# EAGLE design C64_Promenade (EAGLE 9.5.2)
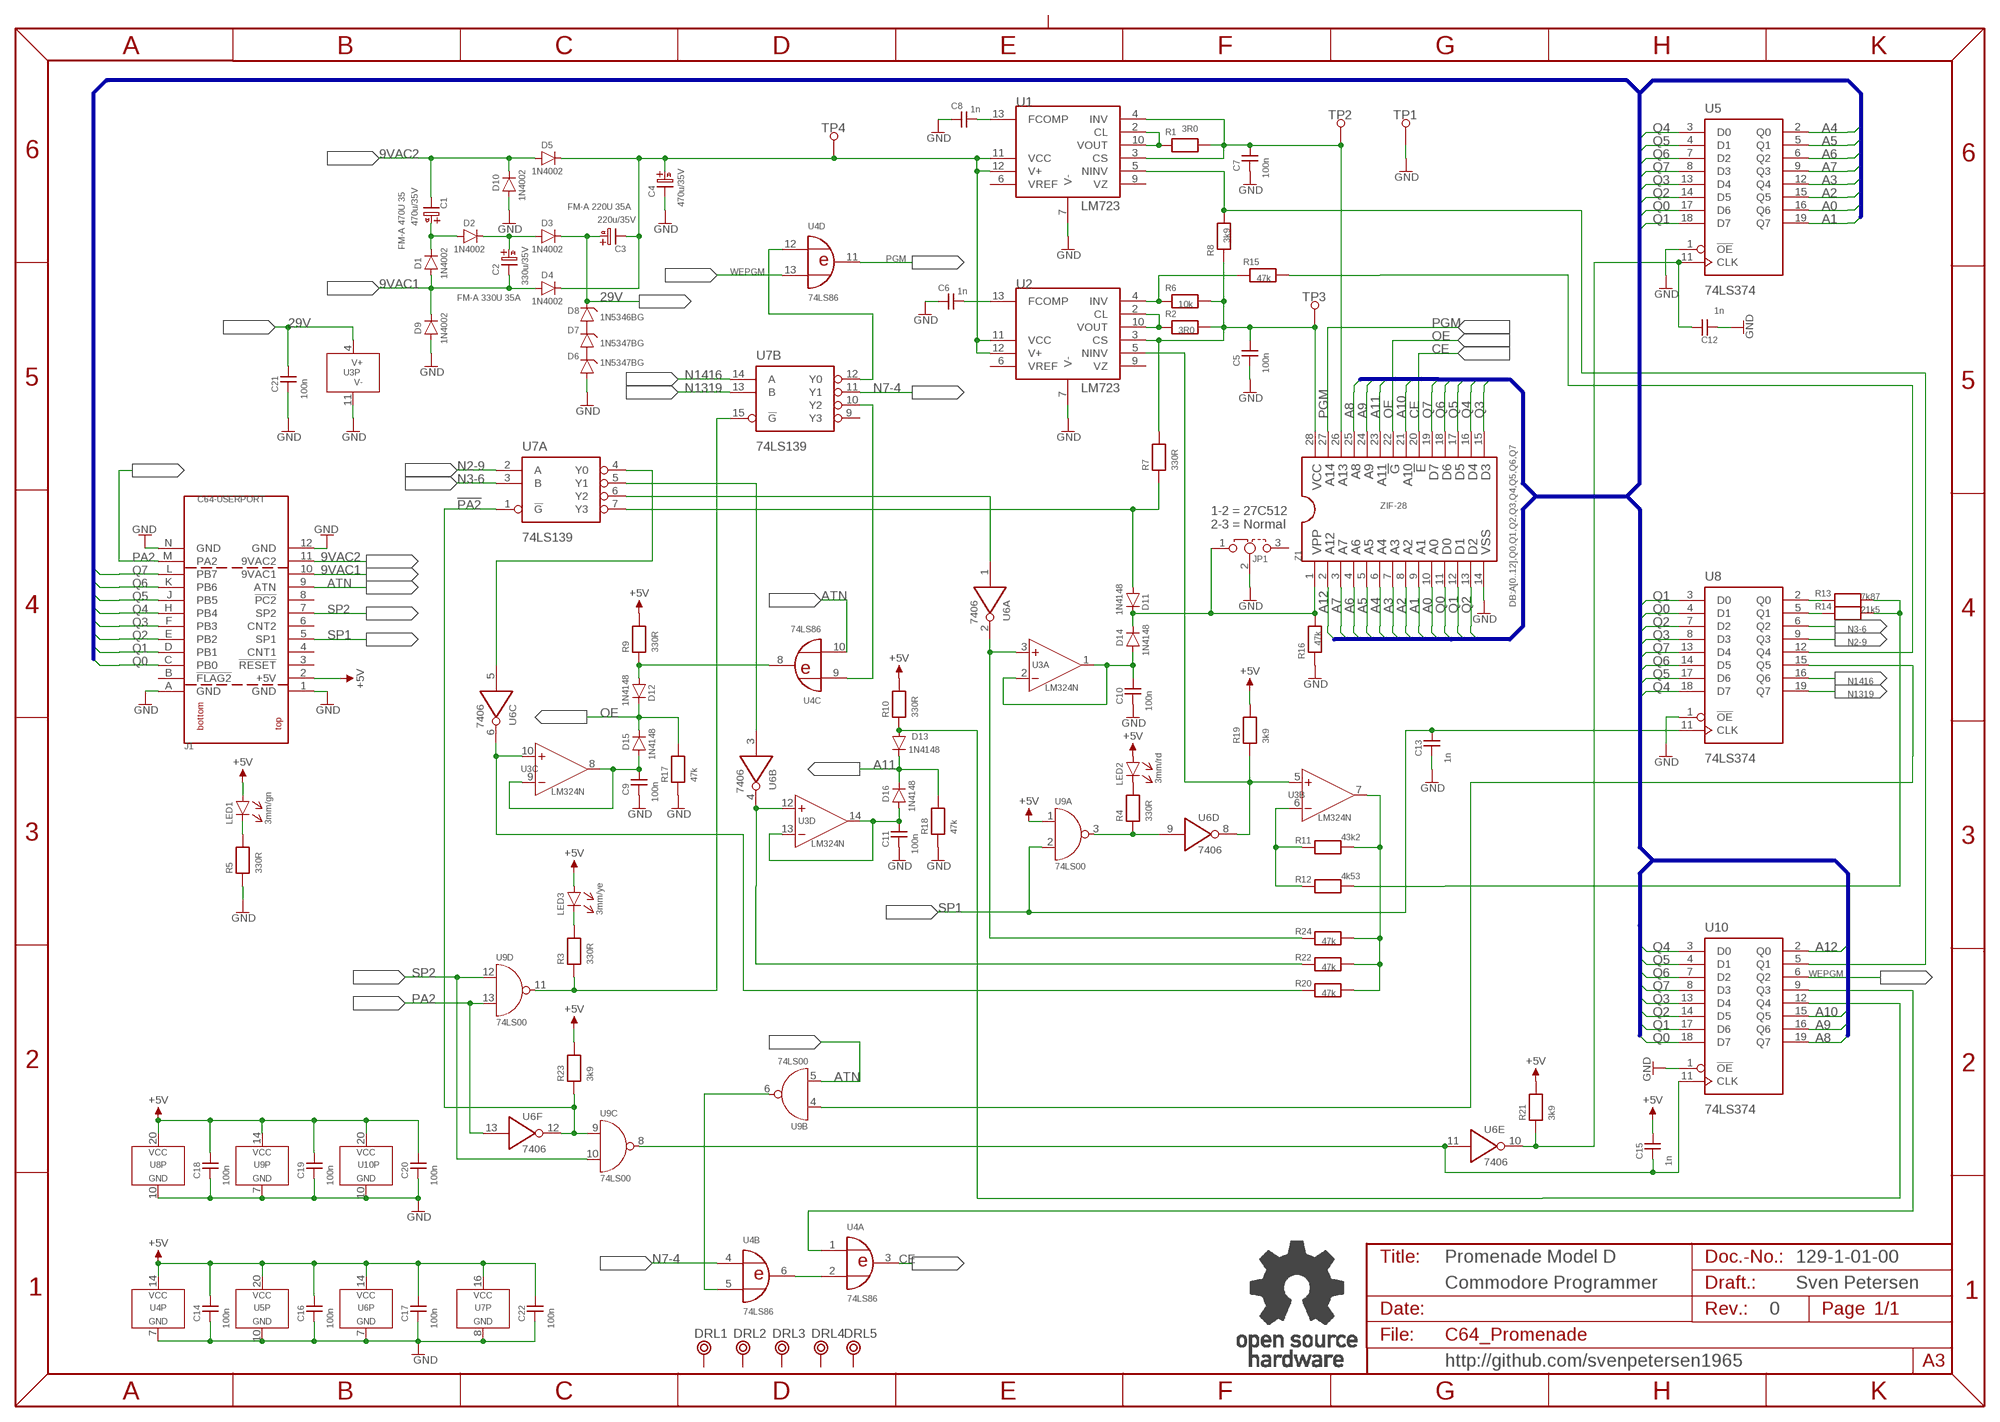
[diagram p0: schematic, sheet 1]

## Parts
C1  470u/35V  C10/5,0  [C10/5,0]
C2  330u/35V  C10/5,0  [C10/5,0]
C3  220u/35V  C10/5,0  [C10/5,0]
C4  470u/35V  C10/5,0  [C10/5,0]
C5  100n  CAP01  [C-2,5]
C6  1n  CAP01  [C-2,5]
C7  100n  CAP01  [C-2,5]
C8  1n  CAP01  [C-2,5]
C9  100n  CAP01  [C-2,5]
C10  100n  CAP01  [C-2,5]
C11  100n  CAP01  [C-2,5]
C12  1n  CAP01  [C-2,5]
C13  1n  CAP01  [C-2,5]
C14  100n  CAP01  [C-2,5]
C15  1n  CAP01  [C-2,5]
C16  100n  CAP01  [C-2,5]
C17  100n  CAP01  [C-2,5]
C18  100n  CAP01  [C-2,5]
C19  100n  CAP01  [C-2,5]
C20  100n  CAP01  [C-2,5]
C21  100n  CAP01  [C-2,5]
C22  100n  CAP01  [C-2,5]
D1  1N4002  [DO-41]
D2  1N4002  [DO-41]
D3  1N4002  [DO-41]
D4  1N4002  [DO-41]
D5  1N4002  [DO-41]
D6  1N5347BG  [017AA]
D7  1N5347BG  [017AA]
D8  1N5346BG  [017AA]
D9  1N4002  [DO-41]
D10  1N4002  [DO-41]
D11  1N4148  [DO-35]
D12  1N4148  [DO-35]
D13  1N4148  [DO-35]
D14  1N4148  [DO-35]
D15  1N4148  [DO-35]
D16  1N4148  [DO-35]
DRL1  BOHR3,5  [BOHR3,5]
DRL2  BOHR3,5  [BOHR3,5]
DRL3  BOHR3,5  [BOHR3,5]
DRL4  BOHR3,5  [BOHR3,5]
DRL5  BOHR3,5  [BOHR3,5]
J1  C64-USERPORT  [USERPORT]
JP1  DJUMPER  [1X03]
LED1  3mm/gn  3MM  [3MM]
LED2  3mm/rd  3MM  [3MM]
LED3  3mm/ye  3MM  [3MM]
R1  3R0  RES04  [R-10]
R2  3R0  RES04  [R-10]
R3  330R  RES04  [R-10]
R4  330R  RES04  [R-10]
R5  330R  RES04  [R-10]
R6  10k  RES04  [R-10]
R7  330R  RES04  [R-10]
R8  3k9  RES04  [R-10]
R9  330R  RES04  [R-10]
R10  330R  RES04  [R-10]
R11  43k2  RES04  [R-10]
R12  4k53  RES04  [R-10]
R13  7k87  RES04  [R-10]
R14  21k5  RES04  [R-10]
R15  47k  RES04  [R-10]
R16  47k  RES04  [R-10]
R17  47k  RES04  [R-10]
R18  47k  RES04  [R-10]
R19  3k9  RES04  [R-10]
R20  47k  RES04  [R-10]
R21  3k9  RES04  [R-10]
R22  47k  RES04  [R-10]
R23  3k9  RES04  [R-10]
R24  47k  RES04  [R-10]
TP1  1,3/2,0  [1,3/2,0]
TP2  1,3/2,0  [1,3/2,0]
TP3  1,3/2,0  [1,3/2,0]
TP4  1,3/2,0  [1,3/2,0]
U1  LM723  [DIL-14]
U2  LM723  [DIL-14]
U3  LM324N  [DIL-14]
U4  74LS86  7486N  [DIL-14]
U5  74LS374  74374N  [DIL-20]
U6  7406  7406N  [DIL-14]
U7  74LS139  74139N  [DIL-16]
U8  74LS374  74374N  [DIL-20]
U9  74LS00  7400DIP  [DIL-14]
U10  74LS374  74374N  [DIL-20]
U$80  OPEN_SOURCE_HW  [OPENHW]
Z1  ZIF-28  [ZIF28]

## Nets
9VAC1: C2.- D1.A D4.A D9.K J1.10(9VAC1)
9VAC2: C1.- D5.A D10.K J1.11(9VAC2)
29V: C3.+ C21.2 D3.K D8.K U3.4(P:V+)
!PA2: R23.1 U6.12(F:O) U7.1(A:!G) U9.9(C:I0)
+5V: C14.2 C15.2 C16.2 C17.2 C18.2 C19.2 C20.2 C22.2 J1.2(+5V) LED1.A LED2.A LED3.A R9.2 R10.2 R19.2 R21.2 R23.2 U4.14(P:VCC) U5.20(VCC) U6.14(P:VCC) U7.16(P:VCC) U8.20(VCC) U9.1(A:I0) U9.14(P:VCC) U10.20(VCC)
A0: U5.16(Q6) Z1.10
A1: U5.19(Q7) Z1.9
A2: U5.15(Q5) Z1.8
A3: U5.12(Q4) Z1.7
A4: U5.2(Q0) Z1.6
A5: U5.5(Q1) Z1.5
A6: U5.6(Q2) Z1.4
A7: U5.9(Q3) Z1.3
A8: U10.19(Q7) Z1.25
A9: U10.16(Q6) Z1.24
A10: U10.15(Q5) Z1.21
A11: D13.K D16.K R18.2 Z1.23
A12: U10.2(Q0) Z1.2
ATN: J1.9(ATN) U4.10(C:I1) U9.5(B:I1)
CE: U4.3(A:O) Z1.20
GND: C4.- C5.1 C6.1 C7.1 C8.1 C9.1 C10.1 C11.1 C12.1 C13.1 C14.1 C16.1 C17.1 C18.1 C19.1 C20.1 C21.1 C22.1 D6.A D9.A D10.A J1.1(GND) J1.12(GND) J1.A(GND) J1.N(GND) JP1.2 R5.1 R16.2 R17.1 R18.1 TP1.1 U1.7(V-) U2.7(V-) U3.11(P:V-) U4.7(P:GND) U5.1(!OE) U5.10(GND) U6.7(P:GND) U7.8(P:GND) U8.1(!OE) U8.10(GND) U9.7(P:GND) U10.1(!OE) U10.10(GND) Z1.14
N2-9: U7.2(A:A) U8.9(Q3)
N3-6: U7.3(A:B) U8.6(Q2)
N7-4: U4.4(B:I0) U7.11(B:Y1)
N1319: U7.13(B:B) U8.19(Q7)
N1416: U7.14(B:A) U8.16(Q6)
N$1: U6.5(C:I) U7.4(A:Y0)
N$2: LED1.C(K) R5.2
N$3: D7.K D8.A
N$4: R3.1 U7.15(B:!G) U9.11(D:O)
N$5: LED3.C(K) R3.2
N$6: U4.2(A:I1) U4.6(B:O)
N$7: C9.2 D15.A U3.8(C:O) U3.9(C:-)
N$8: R20.1 U3.10(C:+) U6.6(C:O)
N$9: U4.5(B:I1) U9.6(B:O)
N$10: D12.A R9.1 U4.8(C:O)
N$11: U4.9(C:I0) U7.10(B:Y2)
N$12: U8.15(Q5) U9.4(B:I0)
N$13: C11.2 D16.A U3.13(D:-) U3.14(D:O)
N$14: R22.1 U3.12(D:+) U6.4(B:O)
N$15: D13.A R10.1 U10.12(Q4)
N$16: D6.K D7.A
N$17: U6.3(B:I) U7.5(A:Y1)
N$18: C10.2 D14.A U3.1(A:O) U3.2(A:-)
N$19: R24.1 U3.3(A:+) U6.2(A:O)
N$20: D11.K D14.K JP1.1 R16.1 Z1.1
N$21: U4.12(D:I0) U7.12(B:Y0)
N$22: U6.1(A:I) U7.6(A:Y2)
N$23: D11.A R7.1 U7.7(A:Y3)
N$24: R4.1 U6.9(D:I) U9.3(A:O)
N$25: LED2.C(K) R4.2
N$26: R19.1 U2.5(NINV) U3.5(B:+) U6.8(D:O)
N$27: R11.1 R12.1 U3.6(B:-)
N$28: C15.1 U6.11(E:I) U9.8(C:O) U10.11(CLK)
N$29: R11.2 R20.2 R22.2 R24.2 U3.7(B:O)
N$30: C12.2 R21.1 U5.11(CLK) U6.10(E:O)
N$31: C1.+ D1.K D2.A
N$33: C2.+ D2.K D3.A
N$34: C8.2 U1.13(FCOMP)
N$35: C3.- C4.+ D4.K D5.K TP4.1 U1.11(VCC) U1.12(V+) U2.11(VCC) U2.12(V+)
N$37: R1.2 U1.2(CL) U1.10(VOUT)
N$38: C6.2 U2.13(FCOMP)
N$39: R2.2 U2.2(CL) U2.10(VOUT)
N$40: C7.2 R1.1 TP2.1 U1.3(CS) U1.4(INV) Z1.26
N$41: R6.2 R15.2 U2.4(INV)
N$42: C5.2 R2.1 R6.1 R7.2 R8.2 TP3.1 U2.3(CS) Z1.28
N$43: R8.1 U1.5(NINV) U10.5(Q1)
N$44: R15.1 U8.12(Q4)
N$45: R14.2 U8.5(Q1)
N$46: R13.2 U8.2(Q0)
N$47: R12.2 R13.1 R14.1
N$49: U4.1(A:I0) U10.9(Q3)
OE: D12.K D15.K R17.2 Z1.22
PA2: J1.M(PA2) U6.13(F:I) U9.13(D:I1)
PGM: U4.11(D:O) Z1.27
Q0: J1.C(PB0) U5.17(D6) U8.4(D1) U10.18(D7) Z1.11
Q1: J1.D(PB1) U5.18(D7) U8.3(D0) U10.17(D6) Z1.12
Q2: J1.E(PB2) U5.14(D5) U8.7(D2) U10.14(D5) Z1.13
Q3: J1.F(PB3) U5.13(D4) U8.8(D3) U10.13(D4) Z1.15
Q4: J1.H(PB4) U5.3(D0) U8.18(D7) U10.3(D0) Z1.16
Q5: J1.J(PB5) U5.4(D1) U8.17(D6) U10.4(D1) Z1.17
Q6: J1.K(PB6) U5.7(D2) U8.14(D5) U10.7(D2) Z1.18
Q7: J1.L(PB7) U5.8(D3) U8.13(D4) U10.8(D3) Z1.19
SP1: C13.2 J1.5(SP1) U8.11(CLK) U9.2(A:I1)
SP2: J1.7(SP2) U9.10(C:I1) U9.12(D:I0)
WEPGM: U4.13(D:I1) U10.6(Q2)
Unconnected: DRL1.P$1 DRL2.P$1 DRL3.P$1 DRL4.P$1 DRL5.P$1 J1.3(!RESET) J1.4(CNT1) J1.6(CNT2) J1.8(!PC2) J1.B(!FLAG2) JP1.3 U1.6(VREF) U1.9(VZ) U2.6(VREF) U2.9(VZ) U7.9(B:Y3)

## Buses
DB:A[0..12],Q0,Q1,Q2,Q3,Q4,Q5,Q6,Q7

## Notes on the sheet
- FM-A 220U 35A
- FM-A 470U 35
- FM-A 330U 35A
- VCC | A14 | A13 | A8 | A9 | A11 | !G | A10 | !E | D7 | D6 | D5 | D4 | D3
- 1-2 = 27C512
  2-3 = Normal
- VPP | A12 | A7 | A6 | A5 | A4 | A3 | A2 | A1 | A0 | D0 | D1 | D2 | VSS
- Promenade Model D | 129-1-01-00
- Commodore Programmer | Sven Petersen
- 0
- http://github.com/svenpetersen1965

## Library data of the parts
C1-C4 = ELCO:C10/5,0
C5-C22 = DISCRETE:CAP01
D1-D5 D9 D10 = Dioden:1N4002
D6 D7 = OnSemi:1N5347BG: Zenerdiode, 10 V, 5 W, Case 017AA
D8 = OnSemi:1N5346BG: Zenerdiode, 9,1 V, 5 W, Case 017AA
D11-D16 = Dioden:1N4148
DRL1-DRL5 = Mech_Bohr:BOHR3,5
J1 = Commodore:C64-USERPORT
JP1 = PINHEAD:DJUMPER
LED1-LED3 = LED:3MM
R1-R24 = DISCRETE:RES04
TP1-TP4 = Pads:1,3/2,0: Testpunkt Typ: 13.70.635 Hersteller: Ettinger Technologie: Einpresstechnik Bauform: - erzeugt von: C. Zellner am: 13.3.2015 letzte Änderung: - Eagle-Version: 6.5.0
U1 U2 = Texas_Instruments:LM723
U3 = Texas_Instruments:LM324
U4 = 74XX:7486
U5 U8 U10 = 74XX:74374
U6 = 74XX:7406
U7 = 74XX:74139
U9 = 74XX:7400: Quad 2-input NAND Gate SO14
U$80 = Logo:OPEN_SOURCE_HW
Z1 = ZIF-Socket:ZIF-28

## Board
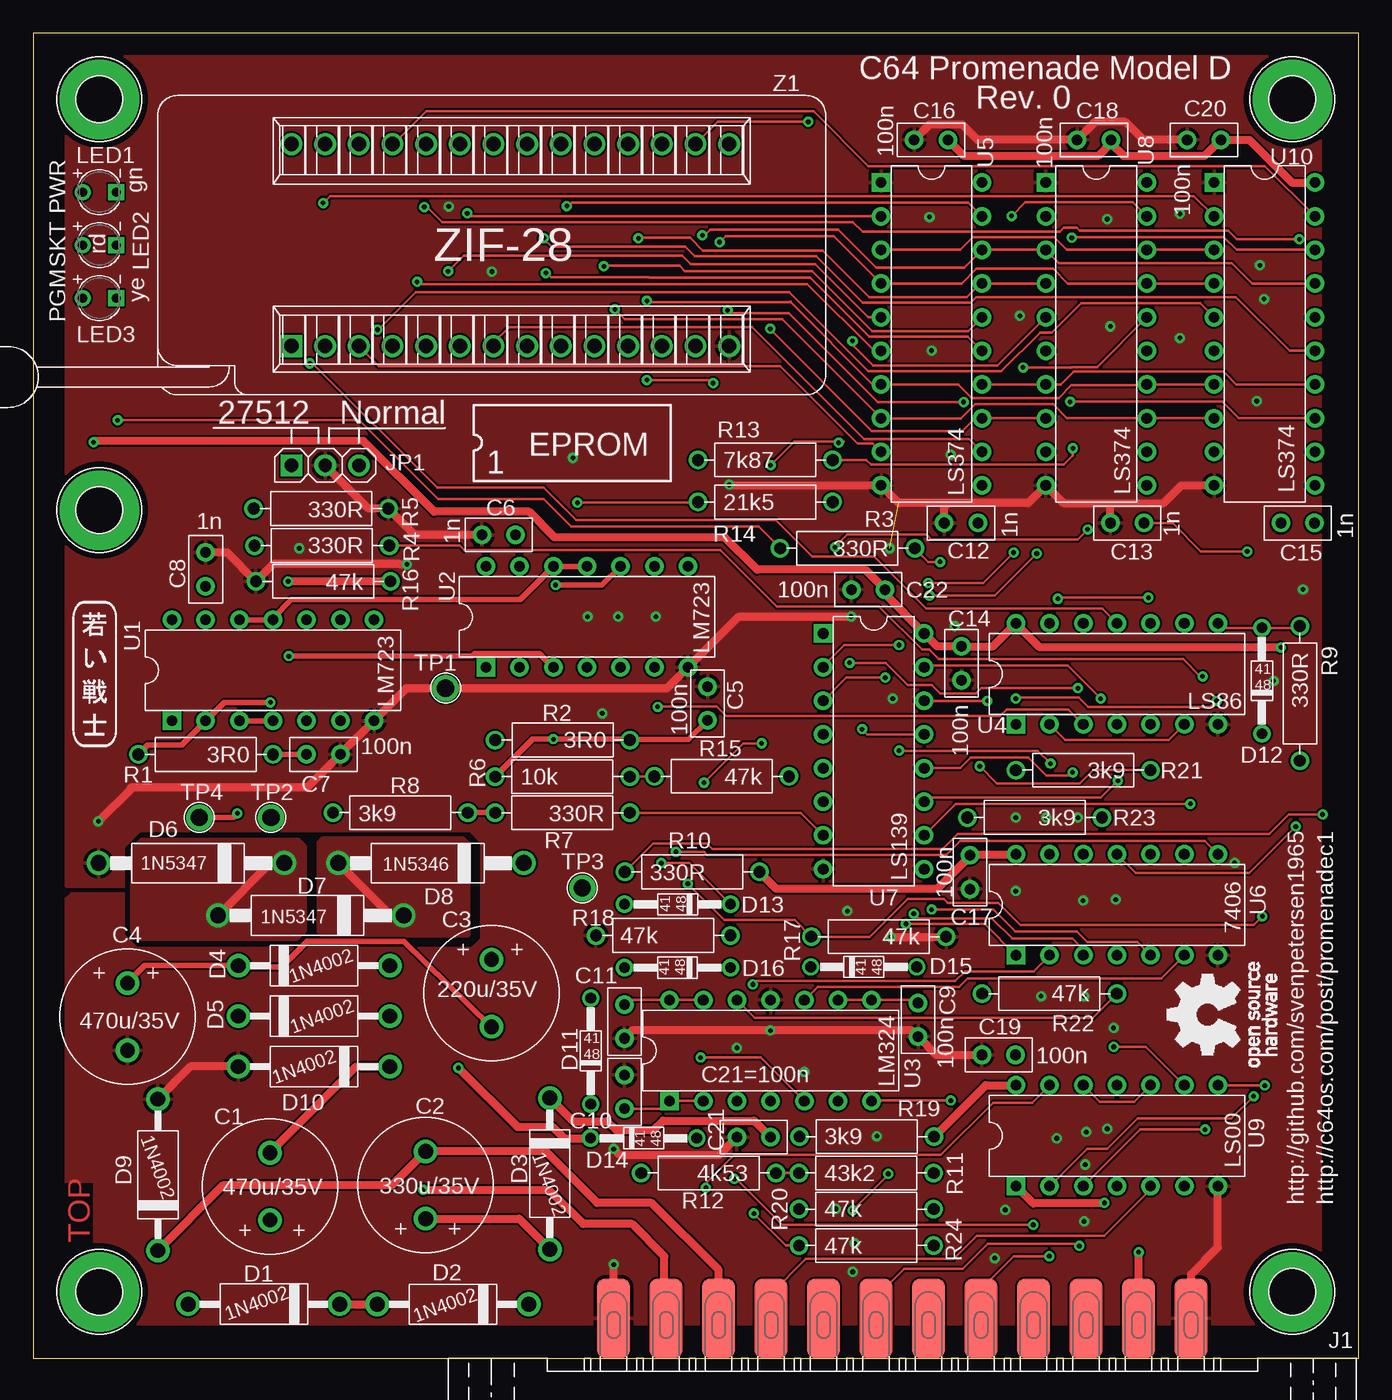
[diagram p1: board, top side]
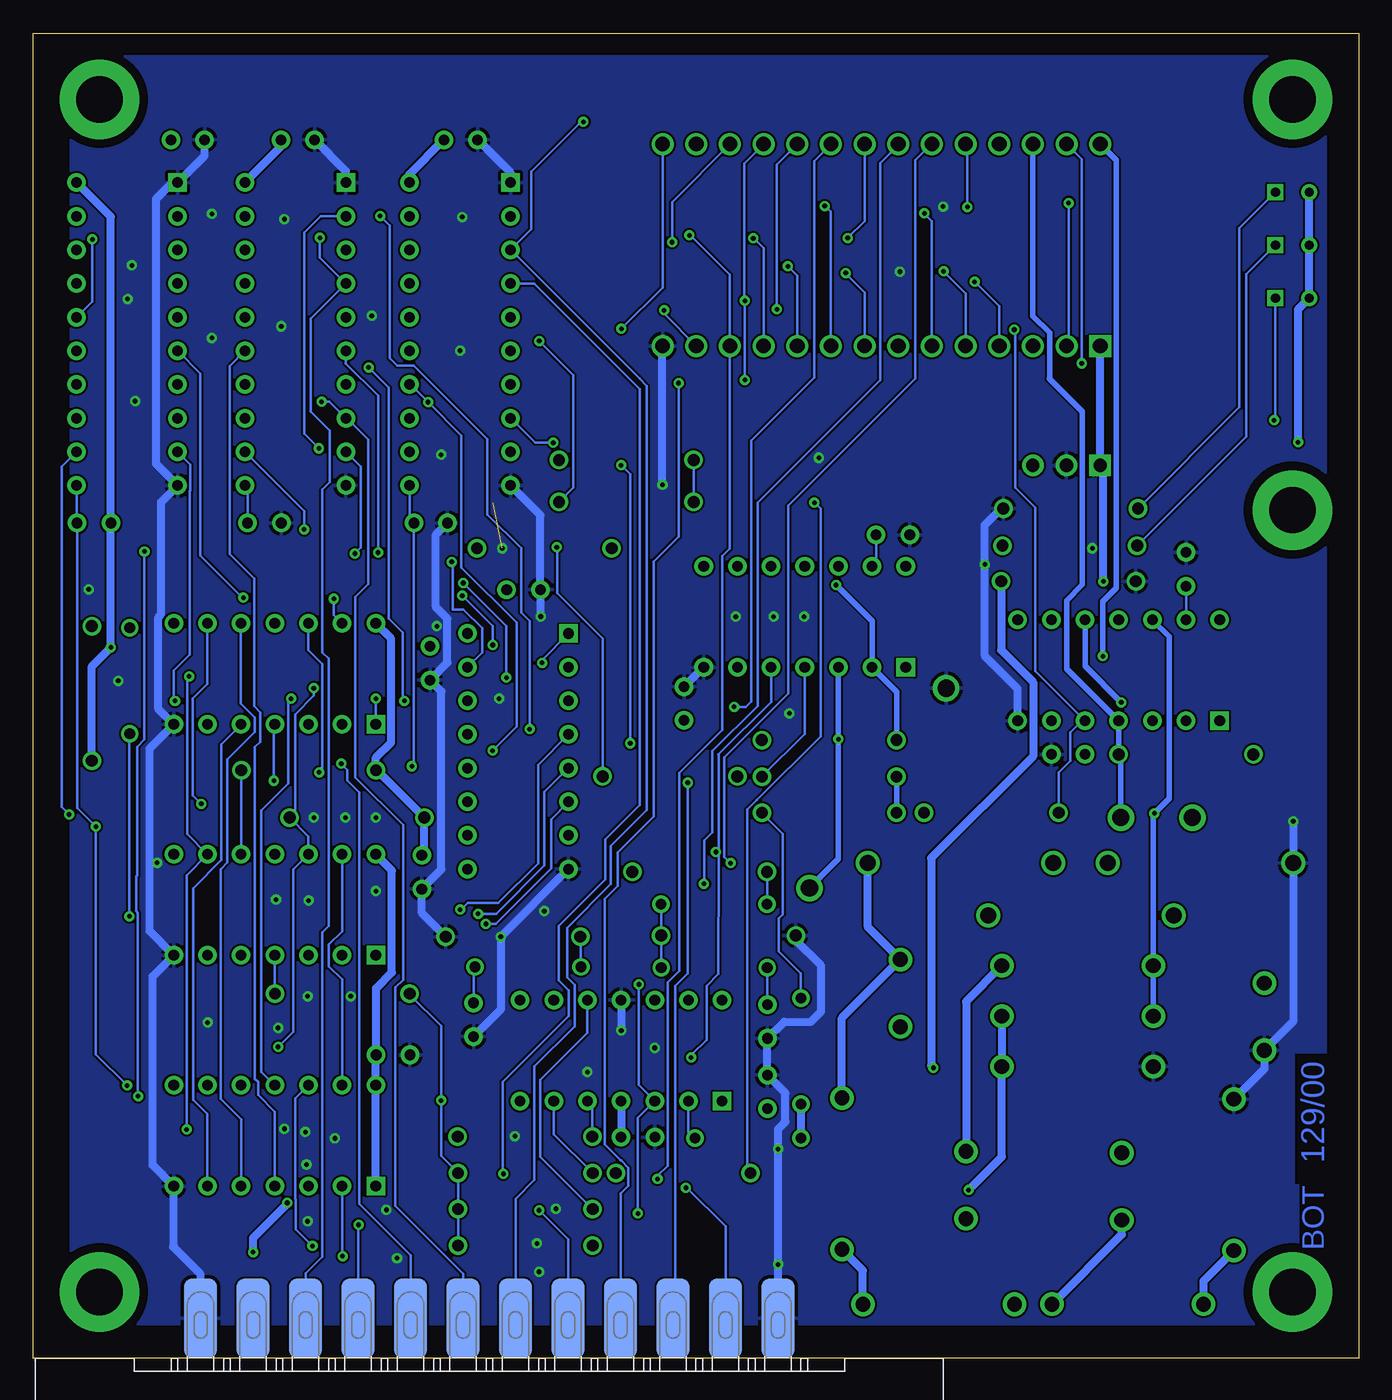
[diagram p2: board, bottom side, seen from below]

Size 100 x 100 mm. Coordinates in mm from the lower left corner, seen from the top.
Outline: 0,0 100,0 100,100 0,100 0,0
Copper layers (1*16): Top 0.035mm / dielectric 1.5mm / Bottom 0.035mm
Design rules "default *": minimum track width 6mil, minimum drill 0.35mm, track to track 6mil, track to pad 6mil, pad to pad 6mil, via to via 6mil, smd to smd 6mil, copper to edge 40mil, drill to drill 6mil, minimum pad ring 10mil, minimum via ring 8mil, stop-mask expansion 4mil, vias tented up to drill 25mil, thermal gap 10mil
bRestrict: 3 lines

### Footprints (pad centres in the part's own frame; a part is rotated, then mirrored left to right if it is on the bottom)
C10/5,0 = drill 1.118 pad 1.778: + -2.54,0; - 2.54,0
C-2,5 = drill 0.8 pad 1.397: 1 -1.27,0; 2 1.27,0
DO-41 = drill 1.118 pad 1.778: A 5.715,0; K -5.715,0
017AA = drill 1.2: A -7,0; K 7,0
DO-35 = drill 0.8: A -4,0; K 4,0
BOHR3,5 = drill 3.5 pad 6: P$1 0,0
USERPORT = smd 2.5 x 6: 1 -21.78,-3; 2 -17.82,-3; 3 -13.86,-3; 4 -9.9,-3; 5 -5.94,-3; 6 -1.98,-3; 7 1.98,-3; 8 5.94,-3; 9 9.9,-3; 10 13.86,-3; 11 17.82,-3; 12 21.78,-3 | smd 2.5 x 6 bottom: A -21.78,-3; B -17.82,-3; C -13.86,-3; D -9.9,-3; E -5.94,-3; F -1.98,-3; H 1.98,-3; J 5.94,-3; K 9.9,-3; L 13.86,-3; M 17.82,-3; N 21.78,-3
1X03 = drill 1 pad 1.626 square: 1 -2.54,0 | drill 1 pad 1.626: 2 0,0; 3 2.54,0
3MM = drill 0.7: A -1.27,0 | drill 0.7 square: C 1.27,0
R-10 = drill 0.889 pad 1.397: 1 -5.08,0; 2 5.08,0
1,3/2,0 = drill 1.3 pad 2: 1 0,0
DIL-14 = drill 0.8 pad 1.397 square: 1 -7.62,-3.81 | drill 0.8 pad 1.397: 2 -5.08,-3.81; 3 -2.54,-3.81; 4 0,-3.81; 5 2.54,-3.81; 6 5.08,-3.81; 7 7.62,-3.81; 8 7.62,3.81; 9 5.08,3.81; 10 2.54,3.81; 11 0,3.81; 12 -2.54,3.81; 13 -5.08,3.81; 14 -7.62,3.81
DIL-20 = drill 0.8 pad 1.397 square: 1 -11.43,-3.81 | drill 0.8 pad 1.397: 2 -8.89,-3.81; 3 -6.35,-3.81; 4 -3.81,-3.81; 5 -1.27,-3.81; 6 1.27,-3.81; 7 3.81,-3.81; 8 6.35,-3.81; 9 8.89,-3.81; 10 11.43,-3.81; 11 11.43,3.81; 12 8.89,3.81; 13 6.35,3.81; 14 3.81,3.81; 15 1.27,3.81; 16 -1.27,3.81; 17 -3.81,3.81; 18 -6.35,3.81; 19 -8.89,3.81; 20 -11.43,3.81
DIL-16 = drill 0.8 pad 1.397 square: 1 -8.89,-3.81 | drill 0.8 pad 1.397: 2 -6.35,-3.81; 3 -3.81,-3.81; 4 -1.27,-3.81; 5 1.27,-3.81; 6 3.81,-3.81; 7 6.35,-3.81; 8 8.89,-3.81; 9 8.89,3.81; 10 6.35,3.81; 11 3.81,3.81; 12 1.27,3.81; 13 -1.27,3.81; 14 -3.81,3.81; 15 -6.35,3.81; 16 -8.89,3.81
ZIF28 = drill 1.1 square: 1 -16.51,-7.62 | drill 1.1: 2 -13.97,-7.62; 3 -11.43,-7.62; 4 -8.89,-7.62; 5 -6.35,-7.62; 6 -3.81,-7.62; 7 -1.27,-7.62; 8 1.27,-7.62; 9 3.81,-7.62; 10 6.35,-7.62; 11 8.89,-7.62; 12 11.43,-7.62; 13 13.97,-7.62; 14 16.51,-7.62; 15 16.51,7.62; 16 13.97,7.62; 17 11.43,7.62; 18 8.89,7.62; 19 6.35,7.62; 20 3.81,7.62; 21 1.27,7.62; 22 -1.27,7.62; 23 -3.81,7.62; 24 -6.35,7.62; 25 -8.89,7.62; 26 -11.43,7.62; 27 -13.97,7.62; 28 -16.51,7.62

### Placement (x,y rotation side)
C1  17.87,12.95 90 top
C2  29.61,13.06 90 top
C3  34.57,27.54 270 top
C4  7.11,25.77 270 top
C5  50.89,49.4 270 top
C6  35.13,62.13 0 top
C7  21.91,45.56 180 top
C8  13.02,59.53 270 top
C9  66.77,25.54 90 top
C10  44.61,20.09 270 top
C11  44.61,25.4 90 top
C12  70.01,63.02 0 top
C13  82.55,63.02 0 top
C14  70.05,52.44 90 top
C15  95.41,63.02 180 top
C16  67.74,91.95 0 top
C17  70.68,36.67 90 top
C18  80.04,91.95 0 top
C19  72.85,22.89 0 top
C20  88.34,91.95 0 top
C21  54.37,16.67 0 top
C22  63,58 0 top
D1  17.41,4.07 180 top
D2  31.68,4.06 180 top
D3  38.98,13.92 270 top
D4  21.2,29.62 0 top
D5  21.2,25.81 0 top
D6  11.93,37.36 0 top
D7  20.95,33.41 0 top
D8  30.02,37.36 0 top
D9  9.41,13.83 90 top
D10  21.2,22 180 top
D11  42.07,23.18 270 top
D12  92.71,51.12 270 top
D13  48.63,34.25 0 top
D14  46.06,16.6 180 top
D15  62.67,29.53 180 top
D16  48.61,29.47 0 top
DRL1  5,5 0 top
DRL2  95,5 0 top
DRL3  95,95 0 top
DRL4  5,95 0 top
DRL5  5,64 0 top
J1  65.58,0 180 top
JP1  22.04,67.38 0 top
LED1  5,88 0 top
LED2  5,84 0 top
LED3  5,80 0 top
R1  13.02,45.56 180 top
R2  39.94,46.65 180 top
R3  61.44,61.12 180 top
R4  21.79,61.32 180 top
R5  21.72,64.12 180 top
R6  39.94,43.88 0 top
R7  39.94,41.16 180 top
R8  27.71,41.16 0 top
R9  95.57,50.16 270 top
R10  49.72,36.69 0 top
R11  62.87,13.97 0 top
R12  50.96,13.97 180 top
R13  55.24,67.79 0 top
R14  55.24,64.61 0 top
R15  51.95,43.91 180 top
R16  21.89,58.63 180 top
R17  63.79,31.8 180 top
R18  47.54,31.9 0 top
R19  62.89,16.71 0 top
R20  62.87,11.24 0 top
R21  79.22,44.37 180 top
R22  76.68,27.51 180 top
R23  75.56,40.8 180 top
R24  62.87,8.5 0 top
TP1  31.11,50.56 0 top
TP2  17.94,40.8 0 top
TP3  41.43,35.48 0 top
TP4  12.54,40.8 0 top
U1  18.1,51.91 0 top
U2  41.78,55.94 0 top
U3  55.64,23.21 0 top
U4  81.77,51.64 0 top
U5  67.78,77.29 270 top
U6  81.77,34.21 0 top
U7  63.42,45.8 270 top
U8  80.21,77.29 270 top
U9  81.77,16.78 0 top
U10  92.91,77.29 270 top
U$70  [PCB-TITLE/]  0,112 0 top  (outside the outline)
U$71  [2LAYER]  4.29,8.73 90 top
U$80  93.82,21.99 90 top
U$81  [SVEN_TAG]  4.68,51.75 0 top
Z1  36,84 0 top

### Tracks (layer width: path | path; a pad name or v marks a point on that pad's centre or on a via)
9VAC1
  Top 0.61: J1.10 51.72,6.65 46.65,11.72 42.55,11.72 38.67,15.6 C2.- 27.04,13.03 14.32,13.03 D9.K
  Bottom 0.61: D4.A 29.61,26.92 C2.- | D1.A 11.7,5.83 D9.K
9VAC2  (via drill 0.35)
  Top 0.61: J1.11 47.63,3.13 47.63,7.68 45.19,10.12 41.49,10.12 38.93,12.68 29.44,12.68 v29.42,12.69 | C1.- 24.38,22 D10.K
  Bottom 0.61: D5.A 26.91,22.3 | 26.91,22.3 D10.K | v29.42,12.69 26.91,15.2 26.91,22.3
29V
  Top 0.61: D3.K 40.73,17.88 43.31,17.88 43.98,17.21 46.83,17.21 47.54,17.91 54.4,17.91 C21.2
  Bottom 0.61: U3.4 C21.2 | D3.K 38.98,25.68 C3.+ 37.02,32.53 D8.K
!PA2  (via drill 0.35)
  Top 0.203: U9.9 83.95,23.49 81.68,23.49 v81.52,23.49 | v78.83,50.56 71.52,50.56 71.12,50.16 68.42,50.16 67.79,50.8 65.98,50.8 64.31,52.47 v61.59,52.47
  Bottom 0.203: v81.52,23.49 80.38,24.63 80.38,36.87 U6.12 79.23,39.38 R23.1 80.24,41.2 80.24,48.58 78.82,50 v78.82,50.56 v78.83,50.56 | v61.59,52.47 61.59,52.7 U7.1
+5V  (via drill 0.35)
  Top 0.61: C16.2 70.2,90.76 80.38,90.76 81.31,91.69 | 81.31,91.69 C18.2 | 81.31,91.69 82.27,90.73 88.39,90.73 C20.2 91.76,91.95 94.99,88.72 U10.20 | v94.14,53.64 75.96,53.64 U4.14 72.41,53.71 C14.2 68.21,53.71 U7.16 64.27,57.65 C22.2 62.76,59.51 54.62,59.51 52.18,61.94 39.35,61.94 37.41,63.88 30.25,63.88 24.91,69.22 4.66,69.22 v4.56,69.12 | R10.2 56.04,35.45 68.25,35.45 70.68,37.88 C17.2 70.76,38.02 U6.14 | R19.2 71.85,20.59 U9.14 | J1.2 v83.4,8 | v80.83,11.72 80.77,11.66 75.47,11.66 74.16,12.97 U9.1
  Bottom 0.61: U5.20 71.59,89.37 C16.2 | U8.20 81.31,91.43 C18.2 | R9.2 95.57,52.21 v94.14,53.64 C15.2 94.14,86.14 U10.20 | v4.56,69.12 4.56,79.17 LED3.A LED2.A LED1.A | C17.2 70.48,38.13 R23.2 74.06,44.37 R21.2 74.14,45.32 72.99,46.46 72.99,54.29 U4.14 | U6.14 72.93,36.8 72.93,29.1 74.12,27.91 C19.2 74.15,22.85 U9.14 U9.1 | v83.4,8 83.4,9.07 80.83,11.65 v80.83,11.72
A0  (via drill 0.35)
  Top 0.203: U5.16 70.55,77.52 63.32,77.52 58.79,82.04 49.17,82.04 48.78,82.44 43.09,82.44 v43.06,82.41
  Bottom 0.203: v43.06,82.41 42.35,81.7 Z1.10
A1  (via drill 0.35)
  Top 0.203: U5.19 70.55,87.22 40.63,87.22 40.36,86.95 v40.28,86.95
  Bottom 0.203: Z1.9 39.81,86.54 40.22,86.95 v40.28,86.95
A2  (via drill 0.35)
  Top 0.203: U5.15 70.52,77.09 63.09,77.09 58.65,81.53 46.49,81.53 46.44,81.58 39.09,81.58 38.77,81.89 v38.69,81.89
  Bottom 0.203: v38.69,81.89 38.69,81.85 37.27,80.43 Z1.8
A3
  Top 0.203: U5.12 70.61,69.38 62.7,69.38 54.26,77.81 35.91,77.81 34.73,76.64 Z1.7
A4  (via drill 0.35)
  Top 0.203: U5.2 32.97,86.18 v32.75,86.4
  Bottom 0.203: v32.75,86.4 32.75,86.39 32.19,85.83 Z1.6
A5  (via drill 0.35)
  Top 0.203: U5.5 63.02,78.56 59.02,82.56 49.62,82.56 48.96,83.21 32.5,83.21 v31.31,82.02
  Bottom 0.203: v31.31,82.02 v31.31,82.01 29.65,80.35 Z1.5
A6  (via drill 0.35)
  Top 0.203: U5.6 63.45,76.02 58.42,81.05 29.15,81.05 v28.97,81.23
  Bottom 0.203: v28.97,81.23 28.95,81.23 27.11,79.4 Z1.4
A7
  Top 0.203: U5.9 63.35,69.02 62.23,69.02 56.38,74.87 26.08,74.87 Z1.3
A8
  Top 0.203: U10.19 92.94,89.96 63.02,89.96 58.89,94.1 29.64,94.1 27.17,91.62 Z1.25
A9  (via drill 0.35)
  Top 0.203: v95.53,84.43 90.8,84.43 90.15,85.08 78.96,85.08 78.73,85.31 77.77,85.31 77.46,85 62.58,85 61.85,85.73 30.88,85.73 29.72,86.88 v29.51,86.88
  Bottom 0.203: U10.16 95.53,79.75 v95.53,84.43 | v29.51,86.88 29.51,91.48 Z1.24
A10  (via drill 0.35)
  Top 0.203: U10.15 94.79,76.02 90.74,80.07 71.15,80.07 70.74,79.66 62.6,79.66 59.09,83.16 49.92,83.16 49.21,83.87 39.12,83.87 38.54,84.45 v38.54,84.54
  Bottom 0.203: Z1.21 37.27,85.83 38.54,84.56 v38.54,84.54
A11  (via drill 0.35)
  Top 0.203: v47.38,37.36 49.52,37.36 D13.K
  Bottom 0.203: Z1.23 32.25,91.62 33.44,90.43 33.44,73.93 43.03,64.35 43.03,50.17 47.86,45.34 47.86,37.84 v47.38,37.36 | D13.K 52.62,34.24 R18.2 D16.K
A12  (via drill 0.35)
  Top 0.203: U10.2 87.58,87.7 22.43,87.7 21.91,87.18 v21.88,87.18
  Bottom 0.203: v21.88,87.18 21.88,76.53 Z1.2
ATN
  Top 0.203: J1.9 55.68,4.87 58.3,7.48 69.45,7.48 71.2,9.23 80.81,9.23 84.31,12.73 U9.5
  Bottom 0.203: U9.5 84.31,18.01 85.86,19.57 85.86,36.89 85.36,37.4 85.36,45.17 83.27,47.26 83.27,48.35 84.32,49.4 U4.10
CE  (via drill 0.35)
  Top 0.203: U4.3 78.1,48.96 73.44,48.96 72.93,48.45 52.31,48.45 51.59,49.17 47.14,49.17 v47.11,49.15
  Bottom 0.203: Z1.20 41.08,90.35 41.08,74 45.83,69.25 45.83,49.55 46.23,49.15 v47.11,49.15
GND  (via drill 0.35)  (1 unrouted)
  Top 0.61: J1.A 87.36,6.33 89.39,8.36 U9.7 | U10.10 86.62,65.86 85.26,64.5 81.44,64.5 | 81.44,64.5 77.77,64.5 U8.10 75.07,64.53 69.03,64.53 | C13.1 81.28,64.33 81.44,64.5 | 69.03,64.53 65.3,64.53 U5.10 52.6,65.86 52.52,65.94 v52.52,65.92 | C12.1 68.74,64.24 69.03,64.53 | C20.1 83.75,91.95 82.39,93.31 80.13,93.31 C18.1 71.25,91.95 70.09,93.11 67.63,93.11 C16.1 | C6.1 28.78,62.13 R5.1 25.3,64.12 JP1.2 | C8.1 14.63,60.8 R16.2 18.11,59.93 27.67,59.93 27.69,59.91 v28.2,59.91 | 25.72,48.12 28.14,50.54 47.81,50.54 U2.7 53.24,55.97 v61.71,55.97 | 25.72,48.12 U1.7 | 25.72,48.12 23.18,45.58 C7.1 20.67,43.05 7.39,43.05 7.39,42.97 v4.93,40.51 | D10.A 11.86,22 D9.A | v64.72,31.8 R17.1 | C21.1 51.73,15.31 44.27,15.31 v43.8,15.78 | C19.1 68.15,22.89 C9.1 66.32,24.72 v55.63,24.72 45.2,24.72 C11.1 | J1.12 v43.8,7.05 43.81,7.06 v43.8,7.06
  Bottom 0.61: J1.A 87.36,6.31 89.45,8.4 89.39,8.45 U9.7 90.99,14.57 90.99,28.81 90.98,28.81 U6.7 91.22,32.23 91.22,46 U4.7 90.55,48.99 90.55,55.93 90.34,56.14 90.34,64.62 U10.10 90.73,67.49 90.73,87.5 89.5,88.72 U10.1 87.07,90.75 C20.1 | U8.1 76.4,89.58 C18.1 | U5.1 63.97,89.45 C16.1 | U1.7 25.72,50.51 28.2,52.99 v28.2,59.91 28.23,59.94 28.23,62.85 26.96,64.12 R5.1 | C5.1 49.43,52.13 U2.7 | v4.93,40.51 D6.A 4.93,25.41 C4.- 7.11,21.84 D9.A | J1.12 v43.8,7.06 v43.8,15.78 43.8,17.3 43.26,17.84 43.26,20 C10.1 C11.1 43.35,25.39 41.32,25.39 40.56,26.16 40.56,29.63 42.46,31.54 R18.1 | C12.1 69.61,62.15 69.61,56.67 68.74,55.8 68.74,52.48 C14.1 69.2,50.32 69.2,36.88 C17.1 70.68,33.6 R17.1 | v52.52,65.92 Z1.14 | U7.8 v64.72,31.8 64.72,26.32 C9.1 | v61.71,55.97 61.71,57.98 C22.1 61.73,63.62 U5.10 | U3.11 55.64,24.73 v55.63,24.72
  other vias: 41.83,55.96 44.13,55.96 46.99,55.96 40.72,67.94 20.08,61.12 42.94,48.66 60.56,11.27 53.1,23.42 77.23,16.59 79.45,17.07 58.18,21.59 63.66,16.75 73.34,11.19 79.3,10.32 81.04,17.3 81.52,24.92 86.84,25.32 81.68,34.61 79.22,34.53 74.14,35.24 76.04,27.3 79.3,27.3 78.82,40.8 76.44,40.8 74.14,40.8 64.61,61.12 95.81,58.02 86.52,76.99 81.28,77.87 92.31,72.23 92.87,79.93 74.45,78.66 92.55,82.47 67.79,76.04 69.22,68.18 67.63,86.12 81.04,85.96 86.52,86.36 61.44,33.73 64.85,49.77 69.53,55.24 90.65,37.39 61.99,8.65 61.83,6.51 72.55,7.54 79.38,14.61 34.61,81.99 31.35,86.92 93.58,51.12
  pour Top: 2.46,2.54 97.16,2.54 97.16,98.27 2.46,98.27 2.46,35.64 2.54,35.56 6.83,35.56 6.83,38.5 8.1,39.77 32.94,39.77 33.81,38.89 33.81,31.67 33.1,30.96 7.86,30.96 6.83,31.99 6.83,35.08 2.86,35.08 2.46,34.69
  pour Bottom: 2.46,2.54 97.16,2.54 97.16,98.27 2.46,98.27
N2-9  (via drill 0.35)
  Top 0.203: v65.33,53.82 61.2,53.82 59.61,52.23 U7.2 | v67.63,57.55 72.55,57.55 v75.72,60.72
  Bottom 0.203: v65.33,53.82 65.33,55.24 v67.63,57.55 | v75.72,60.72 75.29,61.16 75.29,67.29 U8.9
N3-6  (via drill 0.35)
  Top 0.203: U7.3 61.36,51.36 v64.29,51.36 | v67.55,58.5 71.68,58.5 v73.98,60.8
  Bottom 0.203: v64.29,51.36 64.29,55.24 v67.55,58.5 | v73.98,60.8 73.98,72.64 76.4,75.07 U8.6
N7-4  (via drill 0.35)
  Top 0.203: U7.11 67.55,42.31 80.57,42.31 v81.84,43.58
  Bottom 0.203: v81.84,43.58 81.84,47.76 U4.4
N1319  (via drill 0.35)
  Top 0.203: U7.13 62.94,47.07 v62.55,47.47 | v73.82,86.2 74.85,87.23 82.97,87.23 U8.19
  Bottom 0.203: v62.55,47.47 62.55,55.64 63.18,56.28 63.18,61.12 65.72,63.66 65.72,69.36 71.28,74.91 72.53,74.91 73.1,75.49 73.1,85.49 v73.82,86.2
N1416  (via drill 0.35)
  Top 0.203: U8.16 80.27,74.81 78.36,74.81 78.33,74.77 v74.69,74.77 | v71.99,49.61 U7.14
  Bottom 0.203: v74.69,74.77 73.18,73.26 73.18,55.83 72.12,54.77 72.12,49.73 v71.99,49.61
N$1  (via drill 0.35)
  Top 0.203: v67.79,33.86 72.43,33.86 74.09,32.19 78.75,32.19 79.54,31.4 83.31,31.4 U6.5
  Bottom 0.203: U7.4 61.91,44.77 61.91,37.35 64.92,34.34 67.22,34.34 67.79,33.78 | 67.79,33.78 | 67.79,33.78 v67.79,33.86
N$2
  Bottom 0.203: R5.2 9,71.76 9,85.27 LED1.C
N$3
  Top 0.61: D8.A 26.98,33.41 D7.K
  pour Top (no thermals): 21.67,39.05 21.51,38.89 21.51,32.23 21.83,31.91 32.86,31.91 32.86,38.81 32.46,39.21 21.83,39.21
N$4  (via drill 0.35)
  Top 0.203: v80.54,49.77 78.06,52.26 67.34,52.26 U7.15 | v68.42,60.09 67.55,60.09 R3.1
  Bottom 0.203: U9.11 82.79,21.61 82.79,41.33 80.75,43.37 80.75,49.56 v80.54,49.77 | U7.15 66.12,53.26 66.12,55.09 67.55,56.52 68.34,56.52 68.34,60.01 v68.42,60.09
N$5  (via drill 0.35)
  Top 0.203: v6.38,70.79 24.61,70.79 30.58,64.83 38.53,64.83 40.61,62.74 54.73,62.74 R3.2
  Bottom 0.203: LED3.C 6.27,70.89 v6.38,70.79
N$6
  Top 0.203: U4.2 77.88,46.64 85.66,46.64 U4.6
N$7
  Top 0.203: U3.9 U3.8 66.56,27.02 C9.2
  Bottom 0.203: D15.A 66.77,29.43 C9.2
N$8
  Top 0.203: U3.10 59.18,28.02 69.88,28.02 70.51,28.65 85.1,28.65 U6.6
  Bottom 0.203: R20.1 61.75,15.2 61.75,21 58.18,24.56 U3.10
N$9
  Bottom 0.203: U9.6 86.85,18.42 87.94,19.5 87.94,35.46 85.81,37.58 85.81,46.33 U4.5
N$10
  Top 0.203: U4.8 89.72,55.12 D12.A 95.44,55.12 R9.1
N$11  (via drill 0.35)
  Top 0.203: U7.10 69.61,41.83 v87.31,41.83
  Bottom 0.203: v87.31,41.83 87.95,42.47 87.95,49.77 86.85,50.87 U4.9
N$12
  Bottom 0.203: U9.4 81.77,18.6 83.03,19.86 83.03,20.85 83.26,21.08 83.26,46.11 82.86,46.52 82.86,48.74 83.33,49.21 83.33,58.83 85.18,60.67 85.18,74.86 U8.15
N$13
  Top 0.203: U3.13 U3.14 44.96,27.02 C11.2
  Bottom 0.203: D16.A C11.2
N$14
  Top 0.203: U3.12 54.43,25.69 79.94,25.69 R22.1
  Bottom 0.203: R22.1 81.76,30.39 U6.4
N$15  (via drill 0.35)
  Top 0.203: R10.1 46.78,38.84 50.83,38.84 51.23,38.44 68.64,38.44 69.75,39.55 93.28,39.55 94.75,41.03 v97.28,41.03
  Bottom 0.203: D13.A 44.62,36.68 R10.1 | v97.28,41.03 97.84,41.58 97.84,67.28 U10.12
N$16
  Top 0.61: D7.A 17.9,37.36 D6.K
  pour Top (no thermals): 8.18,39.13 20,39.13 20.48,38.66 20.48,32.23 19.84,31.59 8.02,31.59 7.46,32.15 7.46,38.42
N$17  (via drill 0.35)
  Top 0.203: v66.44,33.54 66.78,33.19 72.34,33.19 73.86,31.67 78.39,31.67 79.23,30.82 U6.3
  Bottom 0.203: U7.5 61.42,42.72 61.42,37.18 65.07,33.54 v66.44,33.54
N$18
  Top 0.203: C10.2 47.44,18.82 U3.1 U3.2
  Bottom 0.203: U3.2 50.56,17.09 D14.A
N$19  (via drill 0.35)
  Top 0.203: U6.2 75.49,29.2 70.31,29.2 69.57,28.46 58.33,28.46 58.31,28.48 54.58,28.48 v54.3,28.2 | R24.1 56.77,8.5 54.38,10.89 v54.38,10.92
  Bottom 0.203: v54.3,28.2 54.3,20.6 U3.3 54.38,18.12 v54.38,10.92
N$20  (via drill 0.35)
  Top 0.61: R16.1 v19.25,58.63 v19.25,58.62 | v32.08,21.9 36.55,17.44 39.22,17.44 40.06,16.6 D14.K
  Bottom 0.61: v19.25,58.62 19.25,67.12 JP1.1 Z1.1 | D14.K D11.K | R16.1 26.97,53.42 24.56,51.02 24.56,45.41 32.24,37.73 32.24,22.06 v32.08,21.9
N$21  (via drill 0.35)
  Top 0.203: U7.12 69.93,44.53 70.72,45.32 75.09,45.32 76.44,43.97 78.18,43.97 v78.42,44.21
  Bottom 0.203: v78.42,44.21 78.18,44.45 78.18,52.39 79.23,53.43 U4.12
N$22  (via drill 0.35)
  Top 0.203: v65.84,32.77 71.78,32.77 U6.1
  Bottom 0.203: U7.6 60.93,40.67 60.93,36.94 65.1,32.77 v65.84,32.77
N$23
  Top 0.203: R7.1 57.9,41.16 U7.7
  Bottom 0.203: D11.A 42.07,29.04 43.73,30.7 43.73,33.17 43.43,33.48 43.43,39.57 R7.1
N$24  (via drill 0.35)
  Top 0.203: R4.1 32.18,61.32 32.51,60.99 51.86,60.99 56.1,56.74 63.8,56.74 67.07,53.47 67.59,53.47 68.31,52.75 86.76,52.75 88.06,51.45 v88.23,51.45 | v88.42,17.25 83.51,17.25 U9.3
  Bottom 0.203: v88.23,51.45 88.39,51.29 88.39,39.56 U6.9 86.85,38 88.41,36.45 88.41,17.27 v88.42,17.25
N$25
  Bottom 0.203: R4.2 8.47,69.56 8.47,81.8 LED2.C
N$26  (via drill 0.35)
  Top 0.203: v50.36,22.68 54.9,22.68 U3.5 | U6.8 88.38,39.03 69.94,39.03 68.89,37.98 50.86,37.98 50.62,38.22 48.51,38.22 v48.49,38.2
  Bottom 0.203: U2.5 44.33,49.53 48.3,45.56 48.29,45.54 48.29,38.41 v48.49,38.2 48.28,37.99 48.28,37.61 48.3,28.98 49.19,28.09 49.19,24.03 50.3,22.92 50.3,22.74 v50.36,22.68 | U3.5 57.81,19.03 R19.1
N$27
  Top 0.203: R12.1 R11.1
  Bottom 0.203: R11.1 60.72,16.91 U3.6
N$28  (via drill 0.35)
  Top 0.203: v92.92,20.57 89.41,20.57 U9.8 | v95.26,40.12 91.76,36.61 83.18,36.61 U6.11
  Bottom 0.203: U10.11 96.72,63.06 C15.1 96.68,41.53 v95.26,40.12 95.26,22.92 v92.92,20.57
N$29  (via drill 0.35)
  Top 0.203: v69.22,19.44 63.3,19.44 U3.7
  Bottom 0.203: R24.2 R20.2 R11.2 69.22,15.25 v69.22,19.44 69.21,19.46 69.21,25.05 71.54,27.39 71.6,27.39 R22.2
N$30  (via drill 0.35)
  Top 0.203: v71.42,44.67 72.71,43.38 78.98,43.38 79.97,44.37 R21.1
  Bottom 0.203: U6.10 84.31,44.36 R21.1 | U5.11 71.59,63.34 C12.2 71.28,44.82 v71.42,44.67
N$31
  Top 0.61: D1.K D2.A
  Bottom 0.61: D1.K 17.87,9.33 C1.+
N$33
  Top 0.61: C2.+ 36.66,10.52 D3.A
  Bottom 0.61: D2.K 37.39,6.62 D3.A
N$34
  Bottom 0.203: U1.13 C8.2
N$35  (via drill 0.35)
  Top 0.406: U2.11 U2.12 36.75,57.26 19.48,57.26 18.1,55.87 U1.11 U1.12 | C3.- 27.95,31.45 20.69,31.45 18.76,29.52 15.58,29.52 D4.K 8.43,29.62 C4.+ | TP4.1 15.08,40.8 v15.4,41.12
  Bottom 0.406: U1.12 14.3,54.47 14.3,42.23 v15.4,41.12 15.48,41.04 D4.K D5.K
N$37  (via drill 0.35)
  Top 0.406: R1.2 8.64,46.27 11.21,46.27 13.02,48.08 U1.2 14.41,49.49 v17.9,49.49
  Bottom 0.406: v17.9,49.49 20.64,52.23 U1.10
N$38
  Bottom 0.203: U2.13 36.4,60.06 C6.2
N$39  (via drill 0.35)
  Top 0.406: v39.41,58.34 42.92,58.34 U2.10
  Bottom 0.406: R2.2 34.86,50.29 U2.2 36.7,55.63 v39.41,58.34
N$40
  Top 0.406: C7.2 R1.1 | U1.4 U1.3
  Bottom 0.406: Z1.26 24.57,78.65 23.31,77.39 23.31,73.94 23.32,73.93 20.83,71.43 20.83,58.38 22.02,57.19 22.02,52.02 U1.4 R1.1 17.94,45.4 TP2.1
N$41
  Top 0.203: R6.2 46.85,43.88 R15.2
  Bottom 0.203: U2.4 41.78,47.11 R6.2
N$42  (via drill 0.35)
  Top 0.406: v19.29,52.97 33.1,52.97 33.32,53.19 38.19,53.19 U2.3 | C5.2 49.43,46.68 45.05,46.68 R2.1 44.96,46.71 v39.25,46.71 37.69,46.71 R6.1 | R8.2 R7.2
  Bottom 0.406: v19.29,52.97 19.29,57.1 18.29,58.1 18.29,90.42 Z1.28 | U2.3 v39.25,46.71 39.25,37.66 TP3.1 | R7.2 R6.1
N$43  (via drill 0.35)
  Top 0.203: v25.97,77.62 26.05,77.62 28.87,80.44 57.06,80.44 63,74.5 73.06,74.5 75.97,77.41 75.99,77.39 76.83,77.39 79.06,79.61 88.05,79.61 U10.5
  Bottom 0.203: R8.1 22.63,44.19 21.76,45.06 21.76,47.22 20.88,48.1 U1.5 24.4,51.87 24.4,64.2 25.9,65.7 25.9,77.55 v25.97,77.62
N$44  (via drill 0.35)
  Top 0.203: v60.5,61.2 61.44,62.14 67.42,62.14 67.77,61.79 77.97,61.79 78.8,61.79 v79.55,62.54
  Bottom 0.203: R15.1 57.03,54.3 60.47,57.73 60.47,61.2 v60.5,61.2 | v79.55,62.54 79.55,63.93 U8.12
N$45  (via drill 0.35)
  Top 0.203: U8.5 72.74,74.9 63.38,74.9 61.8,76.47 61.82,76.49 v61.82,76.76
  Bottom 0.203: v61.82,76.76 59.23,74.18 59.23,65.7 R14.2
N$46  (via drill 0.35)
  Top 0.203: R13.2 62.87,67.79 63.23,67.42 77.76,67.42 78.44,68.11 v78.44,68.66
  Bottom 0.203: v78.44,68.66 79.55,69.76 79.55,78.26 79.55,84.95 78.31,86.18 U8.2
N$47  (via drill 0.35)
  Top 0.203: v41.06,64.56 50.12,64.56 R14.1
  Bottom 0.203: R13.1 R14.1 | R12.2 46.12,14.21 46.12,41.41 45.41,42.11 45.39,42.11 40.6,46.91 40.6,64.1 v41.06,64.56
N$49  (via drill 0.35)
  Top 0.203: v89.3,49.61 88.82,49.13 79.61,49.13 78.9,49.85 74.22,49.85 v74.14,49.77
  Bottom 0.203: U10.9 88.15,67.45 88.15,65.47 88.19,65.43 88.19,53.1 89.38,51.91 89.38,49.53 89.3,49.45 v89.3,49.61 | v74.14,49.77 74.14,47.84 U4.1
OE  (via drill 0.35)
  Top 0.203: v92.74,33.34 92.1,32.71 74.46,32.71 72.81,34.35 69,34.35 68.71,34.64 65.97,34.64 63.13,31.8 R17.2 57.45,33.07 52.13,33.07 49.4,35.79 v49.39,35.79
  Bottom 0.203: v92.74,33.34 92.74,47.09 D12.K | Z1.22 34.73,91.54 36.07,90.2 36.07,73.83 45.34,64.57 45.34,49.23 48.76,45.81 48.76,39.68 49.38,39.06 49.38,35.8 v49.39,35.79 | D15.K 58.67,31.75 R17.2
PA2  (via drill 0.35)
  Top 0.203: U9.13 75.37,19.27 72.42,19.27 68.48,15.33 52.89,15.33 50.75,13.2 v50.75,12.86
  Bottom 0.203: U9.13 76.69,28.56 77.68,29.55 77.68,31.22 76.7,32.2 U6.13 | v50.75,12.86 50.67,12.86 47.76,9.94 J1.M
PGM  (via drill 0.35)
  Top 0.203: U4.11 80.65,56.57 67.39,56.57 63.47,60.49 58.78,60.49 56.03,63.24 40.99,63.24 38.53,65.7 30.48,65.7 21.1,75.08 v20.89,75.08
  Bottom 0.203: v20.89,75.08 20.89,90.47 Z1.27
Q0  (via drill 0.35)
  Top 0.203: U8.4 U5.17 71.44,81.1 70.43,80.09 63.08,80.09 59.57,83.59 50.53,83.59 49.57,84.55 45.7,84.55 v45.67,84.52 | U10.18 90.8,83.64 89.82,84.62 78.43,84.62 v78.36,84.55
  Bottom 0.203: v78.36,84.55 78.36,83.06 U8.4 79.06,78.44 79.06,71.44 77.63,70.01 77.63,66.12 78.2,65.55 78.18,53.26 77.71,52.78 77.71,32.62 78.2,32.13 78.2,21.53 78.2,7.64 79.44,6.39 J1.C | v45.67,84.52 45.65,84.52 44.89,83.76 Z1.11
Q1  (via drill 0.35)
  Top 0.203: U10.17 91.98,81.1 90.44,82.64 77.39,82.64 U8.3 U5.18 70.23,82.28 63.62,82.28 60.73,85.17 51.09,85.17 50.65,84.72 50.49,84.72 v50.49,84.75 | v75.45,10.06 75.46,10.06 56.51,10.06 53.05,13.52 v52.89,13.52
  Bottom 0.203: v50.49,84.75 50.41,84.75 47.43,81.76 Z1.12 47.43,61.11 48.01,60.54 48.01,47.41 51.25,44.17 51.25,29.23 52.12,28.36 52.12,18.86 52.12,14.53 52.89,13.75 v52.89,13.52 | v75.45,10.06 75.46,9.48 75.46,2.58 75.47,2.57 J1.D
Q2  (via drill 0.35)
  Top 0.203: U10.14 90.78,73.48 89.81,74.45 78.51,74.45 77.54,73.48 U8.7 U5.14 | v70.2,72.16 63.71,72.16 56.99,78.87 52.61,78.87 v52.4,79.08 | v76.76,44.87 75.79,45.83 65.41,45.83 65.39,45.85 v65.34,45.85
  Bottom 0.203: U5.14 71.53,73.48 v70.2,72.16 67.68,69.64 67.68,59.67 63.51,55.5 63.51,47.67 v65.34,45.85 | v52.4,79.08 52.4,78.81 Z1.13 | J1.E 71.52,7.76 75.39,11.63 75.39,42.69 76.29,43.59 76.29,44.4 v76.76,44.87
Q3  (via drill 0.35)
  Top 0.203: U10.13 90.97,70.94 89.73,72.18 v78.23,72.18 | U8.8 U5.13 71.06,70.94 70.1,69.98 63.28,69.98 55.61,77.65 v55.61,77.69
  Bottom 0.203: v78.23,72.18 77.64,72.18 U8.8 76.32,70.94 74.7,69.32 74.7,58.43 75.7,57.43 75.7,43.83 72.09,40.23 72.09,28.56 72.69,27.97 72.69,11.5 67.56,6.38 J1.F | v55.61,77.69 52.51,80.79 Z1.15
Q4  (via drill 0.35)
  Top 0.203: U10.3 U8.18 77.99,83.64 77.04,84.59 70.9,84.59 69.95,83.64 U5.3 | v58.48,93.31 51.66,93.31 Z1.16
  Bottom 0.203: v58.48,93.31 58.66,93.31 62.42,89.55 62.42,85.19 U5.3 54.25,73.92 53.7,73.37 53.7,41.38 56.42,38.66 56.42,35.77 59.71,32.49 59.71,28.73 59.15,28.16 59.15,25.04 62.19,22 62.19,13.44 63.6,12.03 J1.H
Q5  (via drill 0.35)
  Top 0.203: U10.4 U8.17 78.06,81.1 76.94,82.22 71.17,82.22 70.05,81.1 U5.4 60.4,84.67 52.24,84.67 v51.8,84.22 | v64.52,13.9 64.52,13.85 v61.83,11.16
  Bottom 0.203: v51.8,84.22 51.8,87.25 Z1.17 | U5.4 62.2,81.1 54.23,73.13 54.23,41.75 56.84,39.14 56.84,36.12 60.35,32.6 60.35,28.51 59.61,27.76 59.61,25.83 64.58,20.86 64.58,13.97 v64.52,13.9 | J1.J 59.64,8.97 v61.83,11.16
Q6  (via drill 0.35)
  Top 0.203: U10.7 U8.14 83.97,73.43 78.33,73.43 77.36,72.46 70.82,72.46 69.8,73.48 U5.7 63.36,73.48 57.15,79.69 57.15,79.72 57.12,79.72 46.38,79.72 v46.3,79.8 | v51.3,73.59 51.06,73.83 v46.3,73.83
  Bottom 0.203: Z1.18 46.36,90.15 46.36,79.85 v46.3,79.8 v46.3,73.83 | J1.K 55.68,12.42 55.09,13.02 55.09,14.37 55.64,14.92 55.66,14.92 56.86,16.12 56.86,34.67 55.88,35.65 55.88,38.18 53.16,40.89 53.16,60.12 51.3,61.99 v51.3,73.59
Q7  (via drill 0.35)
  Top 0.203: U10.8 U8.13 77.99,70.94 76.95,71.99 71.09,71.99 70,70.89 64.02,70.89 U5.8 56.51,78.4 44.65,78.4 v43.89,79.16 | v43.89,79.16 43.7,79.16 v43.89,79.16 | v50.61,43.43 53.59,46.41 v54.95,46.41 | v55.64,67.39 57.42,69.17 61.15,69.17 60.85,69.17 v60.76,69.09
  Bottom 0.203: v43.89,79.16 43.89,90.08 Z1.19 | J1.L 51.56,3.16 51.56,28.09 50.62,29.03 50.62,43.43 v50.61,43.43 | v54.95,46.41 54.95,66.7 v55.64,67.39 | v60.76,69.09 62.12,69.09 U5.8
SP1  (via drill 0.35)
  Top 0.203: J1.5 71.52,5.25 73.98,7.7 v76.66,7.7 | C13.2 85.96,63.02 88.11,60.88 v91.6,60.88 | U9.2 79.52,15.8 80.01,15.8 81.02,15.8 83.33,18.1 90.41,18.1 v92.08,19.76
  Bottom 0.203: v76.66,7.7 76.69,7.73 U9.2 | v91.6,60.88 91.6,46.67 92.15,46.12 92.15,36.43 92.23,36.35 92.23,33.73 92.11,33.6 92.11,19.79 v92.08,19.76 | C13.2 83.82,65.66 U8.11
SP2  (via drill 0.35)
  Top 0.203: U9.12 80.48,19.34 83.06,19.34 U9.10 | J1.7 64.57,3.97 64.57,5.57 65.73,6.73 70.12,6.73 72.02,8.63 78.84,8.63 78.84,8.47 v78.92,8.47
  Bottom 0.203: v78.92,8.47 80.19,9.74 80.19,9.82 80.19,11.98 80.22,12.01 80.22,19.6 U9.12
WEPGM  (via drill 0.35)
  Top 0.203: v84.14,57.39 77.39,57.39 v77.31,57.31
  Bottom 0.203: U10.6 87.39,74.31 87.39,60.56 84.22,57.39 v84.14,57.39 | v77.31,57.31 77.31,56.07 U4.13

### Text on the board
Bottom: 129/00
tPlace: C64 Promenade Model D | Rev. 0 | 100n | 100n | gn | PWR | 100n | rd | SKT | ye | PGM | 27512 | Normal | EPROM | 1 | 7k87 | LS374 | LS374 | LS374 | 21k5 | 1n | 330R | 1n | 1n | 1n | 330R | 1n | 330R | 47k | 100n | LM723 | 41 / 48 | LM723 | LS86 | 330R | 100n | 100n | 3R0 | 3R0 | 100n | 3k9 | 10k | 47k | 3k9 | 330R | 3k9 | 1N5347 | 1N5346 | 330R | LS139 | 100n | 41 / 48 | 1N5347 | 7406 | 47k | 47k | 41 / 48 | 41 / 48 | 1N4002 | 220u/35V | 47k | 470u/35V | 1N4002 | 41 / 48 | 100n | 100n | 1N4002 | C21=100n | LM324 | 41 / 48 | 3k9 | LS00 | 4k53 | 43k2 | 1N4002 | 470u/35V | 330u/35V | http://github.com/svenpetersen1965 | http://c64os.com/post/promenadec1 | 1N4002 | 47k | 47k | 1N4002 | 1N4002
Document: Sven Petersen | 129-2-01-00 | 2019 | 35µ | 2 | 0